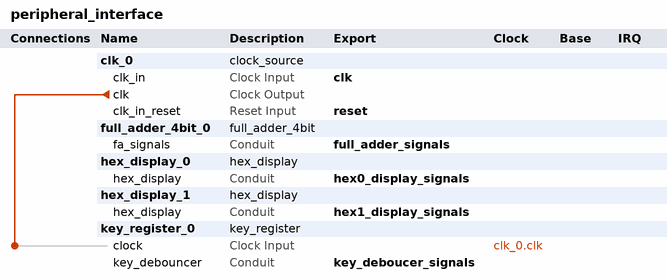
[diagram p0: system contents]
# Platform Designer (Qsys) system peripheral_interface, MAX 10 10M50DAF484C7G
# Parameters at their usual value, and those the tool derives, are not listed.
package require -exact qsys 18.1
create_system peripheral_interface
set_project_property DEVICE_FAMILY {MAX 10}
set_project_property DEVICE 10M50DAF484C7G

add_instance clk_0 clock_source 18.1
set_instance_parameter_value clk_0 clockFrequency 50000000

add_instance full_adder_4bit_0 full_adder_4bit 1.0

add_instance hex_display_0 hex_display 1.0

add_instance hex_display_1 hex_display 1.0

add_instance key_register_0 key_register 1.0

# connections
add_connection clk_0.clk key_register_0.clock clock

# exported interfaces
add_interface clk clock sink
set_interface_property clk EXPORT_OF clk_0.clk_in
add_interface full_adder_signals conduit end
set_interface_property full_adder_signals EXPORT_OF full_adder_4bit_0.fa_signals
add_interface hex0_display_signals conduit end
set_interface_property hex0_display_signals EXPORT_OF hex_display_0.hex_display
add_interface hex1_display_signals conduit end
set_interface_property hex1_display_signals EXPORT_OF hex_display_1.hex_display
add_interface key_deboucer_signals conduit end
set_interface_property key_deboucer_signals EXPORT_OF key_register_0.key_debouncer
add_interface reset reset sink
set_interface_property reset EXPORT_OF clk_0.clk_in_reset

set_interconnect_requirement {$system} qsys_mm.clockCrossingAdapter HANDSHAKE
set_interconnect_requirement {$system} qsys_mm.enableEccProtection FALSE
set_interconnect_requirement {$system} qsys_mm.insertDefaultSlave FALSE
set_interconnect_requirement {$system} qsys_mm.maxAdditionalLatency 1

save_system peripheral_interface.qsys
